# EAGLE design Add-OnV5 (EAGLE 6.3)
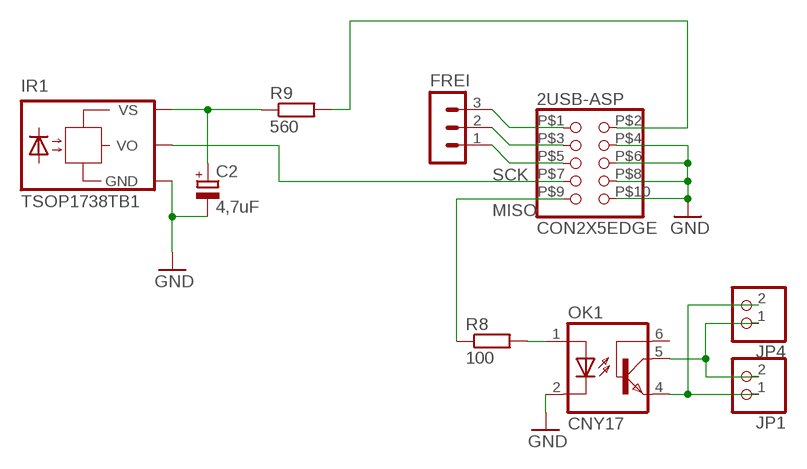
[diagram p0: schematic, sheet 1]

## Parts
2USB-ASP  CON2X5EDGE  [CON2X5EDGE]
C2  4,7uF  CPOL-EUE1.8-4  [E1,8-4]
FREI  MA03-1  [MA03-1]
IR1  TSOP1738TB1  [TSOP17_TB1]
JP1  PINHD-1X2  [1X02]
JP4  PINHD-1X2  [1X02]
OK1  CNY17  [DIL06]
R8  100  R-EU_0204/7  [0204/7]
R9  560  R-EU_0204/7  [0204/7]

## Nets
GND: 2USB-ASP.P$4 2USB-ASP.P$6 2USB-ASP.P$8 2USB-ASP.P$10 C2.- IR1.GND OK1.2(C)
MISO: 2USB-ASP.P$9 R8.1
N$1: C2.+ IR1.VS R9.1
N$2: OK1.1(A) R8.2
N$3: JP1.2 JP4.1 OK1.5(COL)
N$4: JP1.1 JP4.2 OK1.4(EMI)
N$5: 2USB-ASP.P$2 R9.2
N$6: 2USB-ASP.P$5 FREI.1
N$7: 2USB-ASP.P$3 FREI.2
N$8: 2USB-ASP.P$1 FREI.3
SCK: 2USB-ASP.P$7 IR1.VO
Unconnected: OK1.6(BAS)

## Library data of the parts
2USB-ASP = schwen:CON2X5EDGE
C2 = rcl:CPOL-EU: POLARIZED CAPACITOR, European symbol
FREI = con-lstb:MA03-1: PIN HEADER; OC_FARNELL: unknown; OC_NEWARK: unknown
IR1 = telefunken:TSOP17*TB1: TSOP17..TB1 IR Receiver Modules for Remote Control Systems Source: http://www.vishay.com/docs/82042/82042.pdf; OC_FARNELL: unknown; OC_NEWARK: unknown
JP1 JP4 = pinhead:PINHD-1X2: PIN HEADER
OK1 = optocoupler:CNY17: SIEMENS OPTO COUPLER; MPN: CNY17-1; OC_FARNELL: 1045399; OC_NEWARK: 05M4044
R8 R9 = rcl:R-EU_: RESISTOR, European symbol

## Board
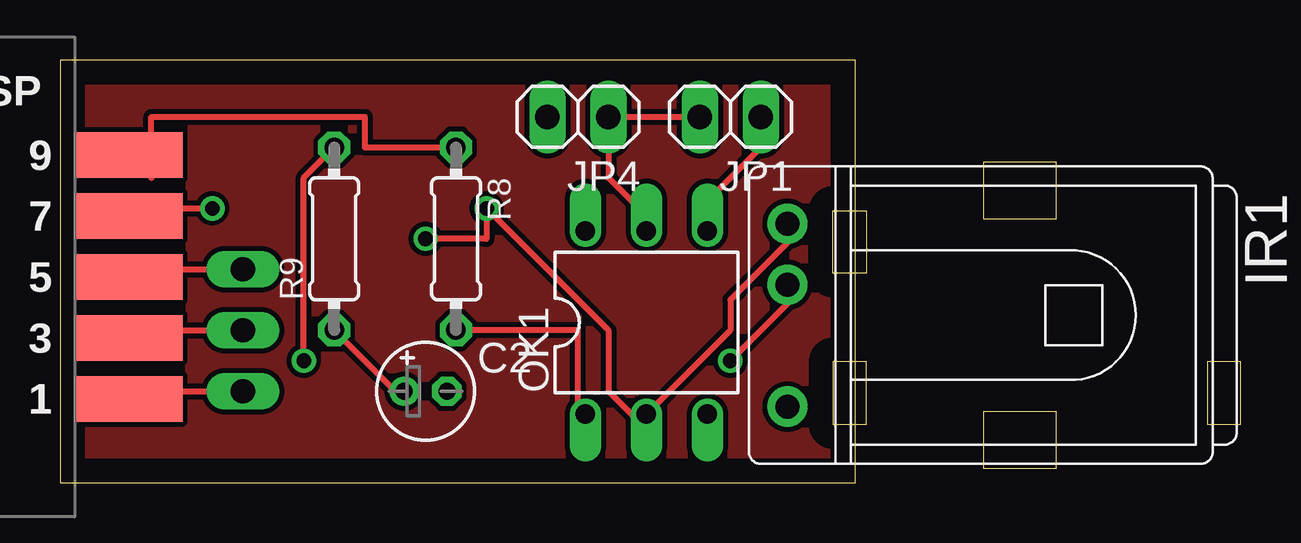
[diagram p1: board, top side]
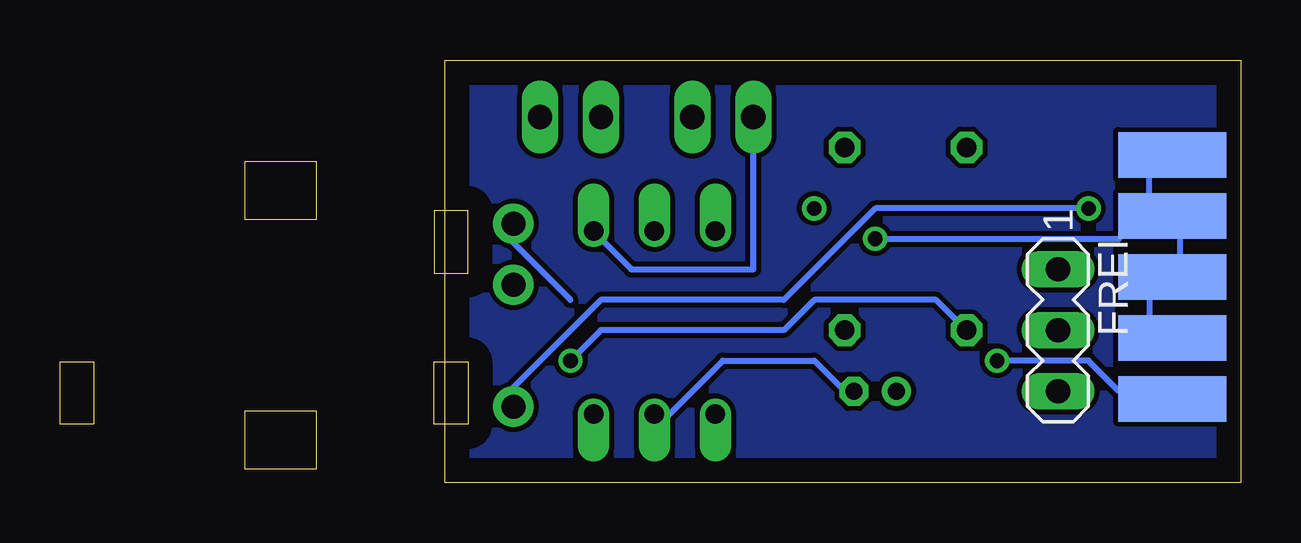
[diagram p2: board, bottom side, seen from below]

Size 33.16 x 17.61 mm. Coordinates in mm from the lower left corner, seen from the top.
Outline: 0,0 33.16,0 33.16,17.61 0,17.61 0,0
Copper layers (1*16): Top 0.035mm / dielectric 1.5mm / Bottom 0.035mm
Design rules "default": minimum track width 10mil, minimum drill 24mil, track to track 8mil, track to pad 8mil, pad to pad 8mil, via to via 8mil, smd to smd 8mil, copper to edge 40mil, drill to drill 8mil, minimum pad ring 10mil, minimum via ring 8mil, stop-mask expansion 4mil, vias tented up to drill 0mil, thermal gap 10mil

### Footprints (pad centres in the part's own frame; a part is rotated, then mirrored left to right if it is on the bottom)
CON2X5EDGE = smd 4.5 x 1.9: P$1 0,5.08; P$3 0,2.54; P$5 0,0; P$7 0,-2.54; P$9 0,-5.08 | smd 4.5 x 1.9 bottom: P$2 0,5.08; P$4 0,2.54; P$6 0,0; P$8 0,-2.54; P$10 0,-5.08
E1,8-4 = drill 0.711 pad 1.168: + -0.889,0 | drill 0.711 pad 1.168 octagon: - 0.889,0
MA03-1 = drill 1.016 long: 1 -2.54,0; 2 0,0; 3 2.54,0
TSOP17_TB1 = drill 1 pad 1.676: GND 0,-3.81; VO 0,3.81; VS 0,-1.27
1X02 = drill 1.016 long: 1 -1.27,0; 2 1.27,0
DIL06 = drill 0.813 offset: 1 -2.54,-3.81; 2 0,-3.81; 3 2.54,-3.81; 4 2.54,3.81; 5 0,3.81; 6 -2.54,3.81
0204/7 = drill 0.813 octagon: 1 -3.81,0; 2 3.81,0

### Placement (x,y rotation side)
2USB-ASP  2.86,8.57 180 top
C2  15.24,3.81 0 top
FREI  7.62,6.35 270 bottom
IR1  30.32,6.98 180 top
JP1  27.94,15.24 180 top
JP4  21.59,15.24 180 top
OK1  24.44,6.67 0 top
R8  16.51,10.16 270 top
R9  11.43,10.16 90 top

### Tracks (layer width: path | path; a pad name or v marks a point on that pad's centre or on a via)
GND  (via drill 0.61)
  Top 0.254: 24.13,2.54 27.94,6.35 27.94,7.62 30.48,10.16 IR1.GND | 24.13,2.54 22.86,3.81 22.86,6.35 v17.78,11.43 17.78,10.16 v15.24,10.16 | 24.13,2.54 OK1.2
  Bottom 0.254: 27.94,7.62 30.48,10.16 IR1.GND | C2.- 16.51,3.81 17.78,5.08 21.59,5.08 24.13,2.54 OK1.2 | 2USB-ASP.P$4 3.81,6.35 3.81,8.89 2USB-ASP.P$6 2.54,8.89 2.54,11.43 2USB-ASP.P$8 3.81,11.43 | 3.81,11.43 3.81,13.97 2USB-ASP.P$10 | 3.81,11.43 5.08,10.16 v15.24,10.16
MISO
  Top 0.254: 3.81,13.97 3.81,12.7 | R8.1 12.7,13.97 12.7,15.24 3.81,15.24 3.81,13.97 | 3.81,13.97 2USB-ASP.P$9
N$1  (via drill 0.61)
  Top 0.254: R9.1 13.97,3.81 C2.+ | v27.94,5.08 30.48,7.62 IR1.VS
  Bottom 0.254: v27.94,5.08 26.67,6.35 19.05,6.35 17.78,7.62 12.7,7.62 R9.1
N$2
  Top 0.254: R8.2 21.59,6.35 21.59,2.54 OK1.1
N$3
  Top 0.254: OK1.5 24.13,11.43 22.86,12.7 JP4.1 JP1.2
N$4
  Top 0.254: JP1.1 29.21,13.97 26.67,11.43 OK1.4
  Bottom 0.254: JP4.2 20.32,8.89 25.4,8.89 26.67,10.16 OK1.4
N$5  (via drill 0.61)
  Top 0.254: R9.2 10.16,12.7 v10.16,5.08
  Bottom 0.254: v10.16,5.08 6.35,5.08 5.08,3.81 3.81,3.81 2USB-ASP.P$2
N$6
  Top 0.254: FREI.1 3.81,8.89 2USB-ASP.P$5
N$7
  Top 0.254: FREI.2 3.81,6.35 2USB-ASP.P$3
N$8
  Top 0.254: FREI.3 3.81,3.81 2USB-ASP.P$1
N$9
  pour Top: 0,17.78 33.02,17.78 33.02,0 0,0
N$10
  pour Bottom: 0,17.78 0,0 33.02,0 33.02,17.78
SCK  (via drill 0.61)
  Top 0.254: v6.35,11.43 3.81,11.43 2USB-ASP.P$7
  Bottom 0.254: v6.35,11.43 15.24,11.43 19.05,7.62 26.67,7.62 30.48,3.81 IR1.VO